# Altium project HW_Z-BAND_SMART_AMP_R1.PrjPcb (part 2 of 4)

## Sheet 05_3V3_GENERATION.SchDoc: =TitleParameter
size A3; Date: 6/12/2026; ApprovedBy: U.KAYACIK; CheckedBy: E. CAGLAV; DrawnBy: E. CAGLAV; Organization: ASISGUARD; Address1: Kemalpasa, Kemalpasa Cd. No:290 D:292H, 35060 Bornova/Izmir/Turkey; Revision: R1; SheetNumber: 5; SheetTotal: 12
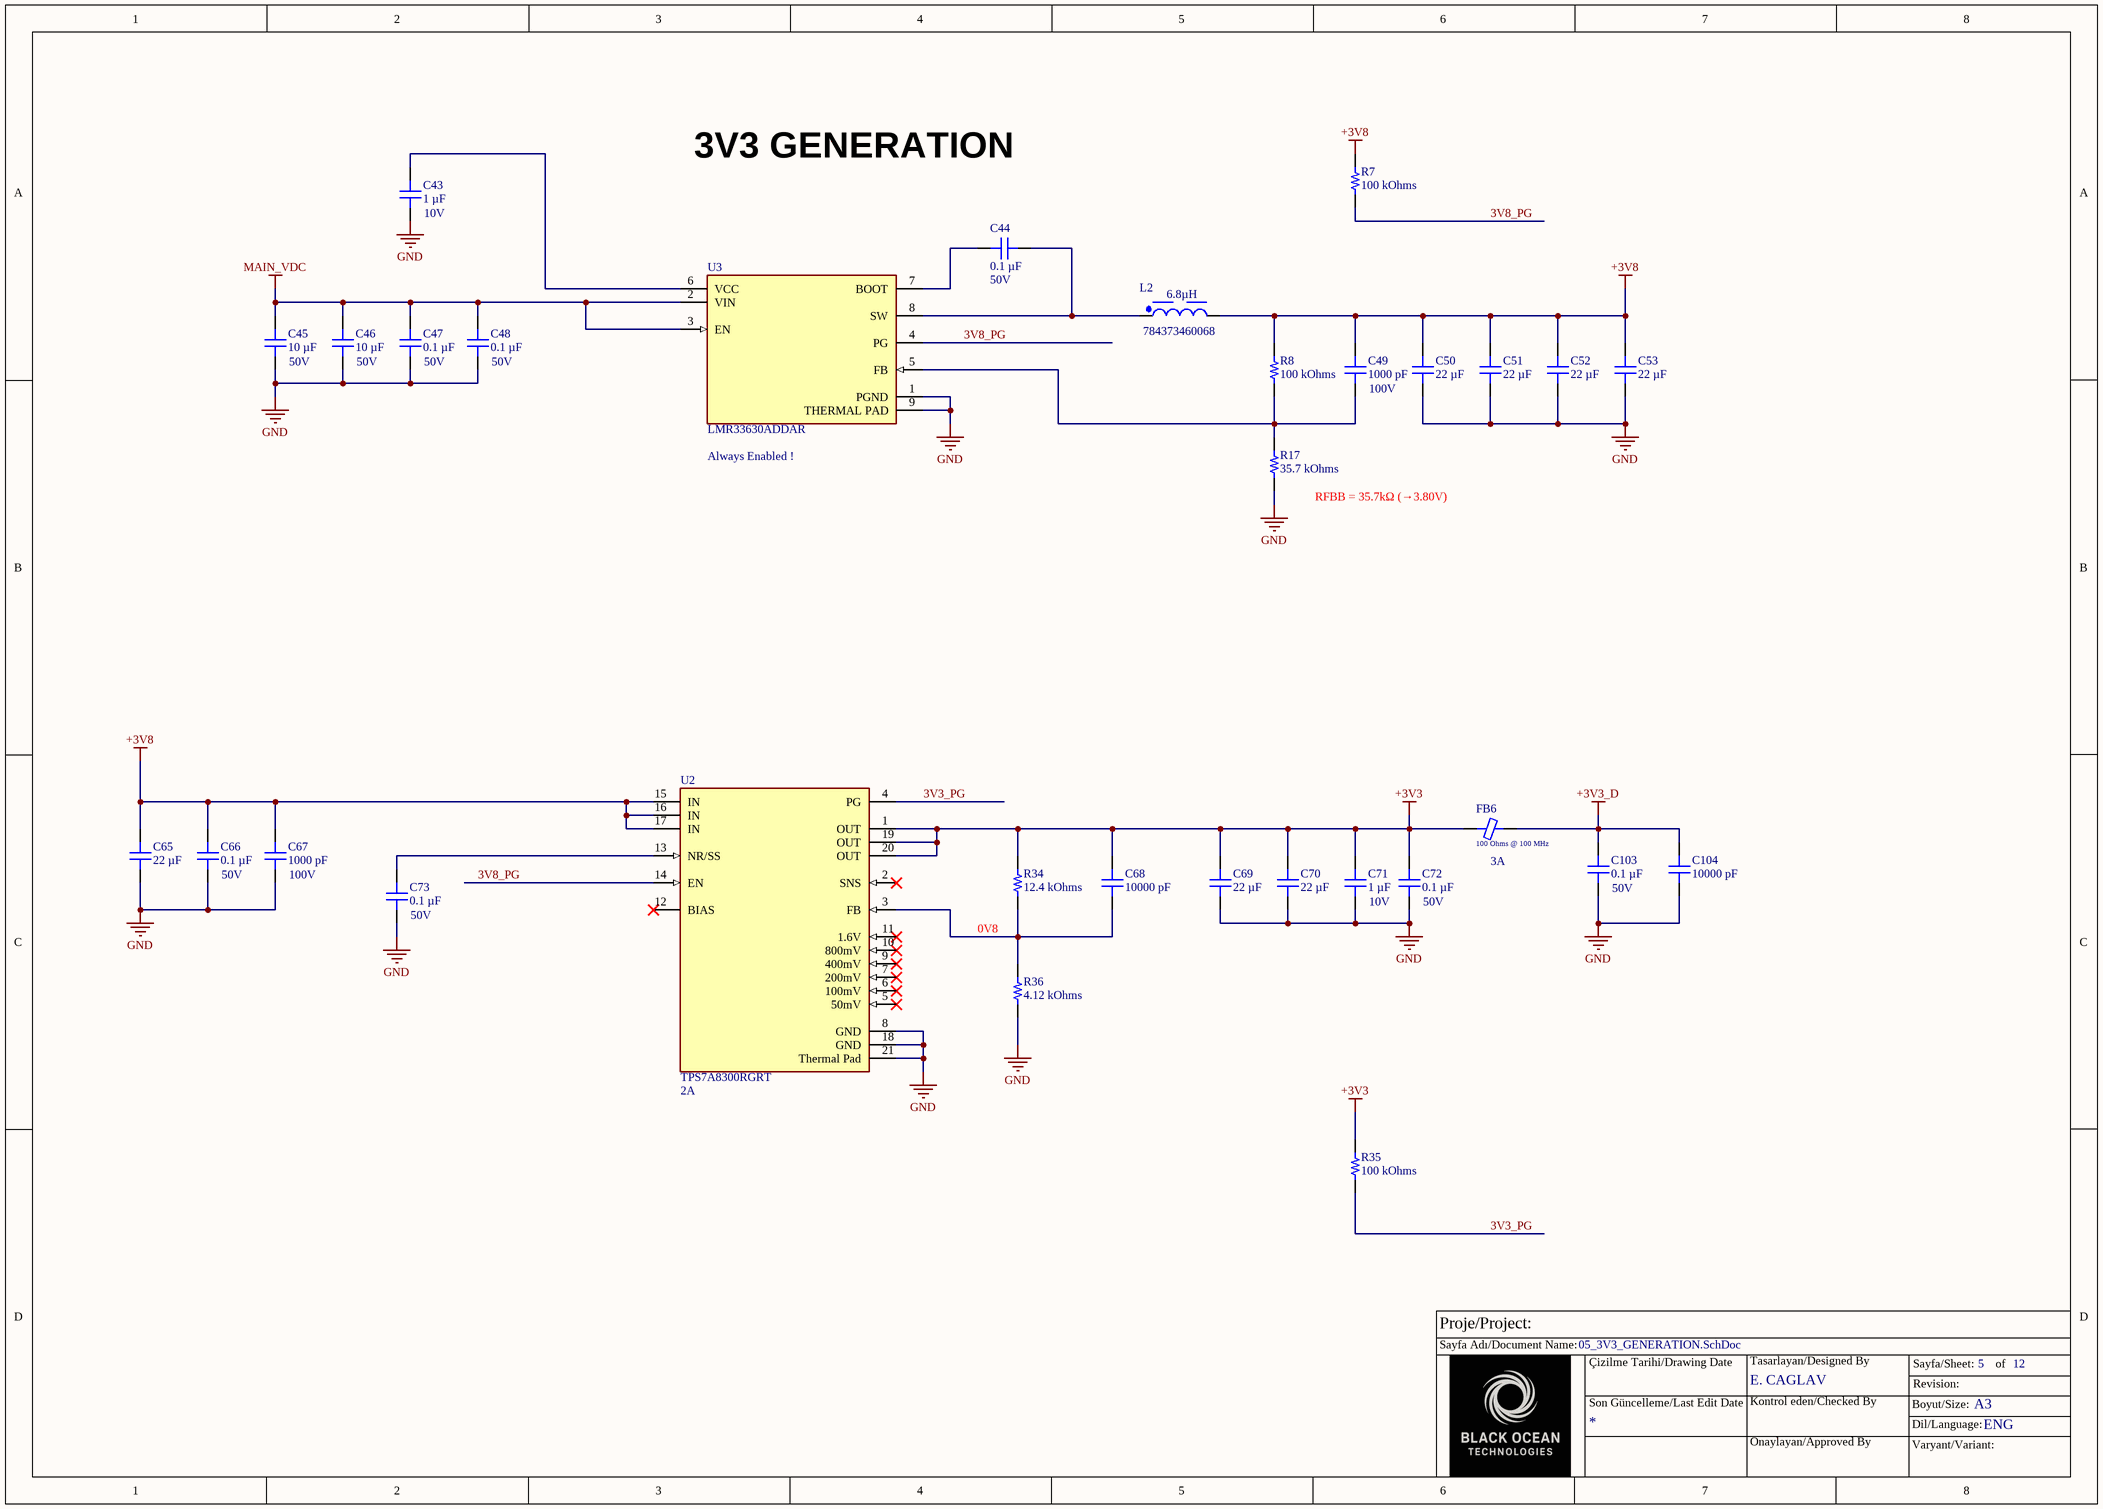
[diagram p4: 05_3V3_GENERATION.SchDoc]

### Parts
C43  Voltage - Rated: 10V  [CAP 0402_1005]  (hidden comment: 1 µF)
C44  Voltage - Rated: 50V  [CAP 0402_1005]  (hidden comment: 0.1 µF)
C45  Voltage - Rated: 50V  [CAP 1206_3216 - 0.8MM]  (hidden comment: 10 µF)
C46  Voltage - Rated: 50V  [CAP 1206_3216 - 0.8MM]  (hidden comment: 10 µF)
C47  Voltage - Rated: 50V  [CAP 0402_1005]  (hidden comment: 0.1 µF)
C48  Voltage - Rated: 50V  [CAP 0402_1005]  (hidden comment: 0.1 µF)
C49  Voltage - Rated: 100V  [CAP 0402_1005]  (hidden comment: 1000 pF)
C50  22 µF  [CAP 0805_2012]
C51  22 µF  [CAP 0805_2012]
C52  22 µF  [CAP 0805_2012]
C53  22 µF  [CAP 0805_2012]
C65  22 µF  [CAP 0805_2012]
C66  Voltage - Rated: 50V  [CAP 0402_1005]  (hidden comment: 0.1 µF)
C67  Voltage - Rated: 100V  [CAP 0402_1005]  (hidden comment: 1000 pF)
C68  10000 pF  [CAP 0402_1005]
C69  22 µF  [CAP 0805_2012]
C70  22 µF  [CAP 0805_2012]
C71  Voltage - Rated: 10V  [CAP 0402_1005]  (hidden comment: 1 µF)
C72  Voltage - Rated: 50V  [CAP 0402_1005]  (hidden comment: 0.1 µF)
C73  Voltage - Rated: 50V  [CAP 0402_1005]  (hidden comment: 0.1 µF)
C103  Voltage - Rated: 50V  [CAP 0402_1005]  (hidden comment: 0.1 µF)
C104  10000 pF  [CAP 0402_1005]
FB6  100 Ohms @ 100 MHz  Current Rating (Max): 3A  [FER 0603_1608]
L2  784373460068  Inductance: 6.8µH  [WE-LHCA_7030]
R7  100 kOhms  [RES 0402_1005]
R8  100 kOhms  [RES 0402_1005]
R17  35.7 kOhms  [RES 0402_1005]
R34  12.4 kOhms  [RES 0402_1005]
R35  100 kOhms  [RES 0402_1005]
R36  4.12 kOhms  [RES 0402_1005]
U2  TPS7A8300RGRT  Output Current: 2A  [FP-RGR0020A-MFG]
U3  LMR33630ADDAR  [FP-DDA0008J-MFG]

### Nets
+3V3: C68.2 C69.2 C70.2 C71.1 C72.2 FB6.2 R34.2 R35.2 U2.1(OUT) U2.19(OUT) U2.20(OUT)
+3V3_D: C103.2 C104.2 FB6.1
+3V8: C49.2 C50.2 C51.2 C52.2 C53.2 C65.2 C66.2 C67.2 L2.2 R7.2 R8.2 U2.15(IN) U2.16(IN) U2.17(IN)
GND: C43.2 C45.1 C46.1 C47.1 C48.1 C50.1 C51.1 C52.1 C53.1 C65.1 C66.1 C67.1 C69.1 C70.1 C71.2 C72.1 C73.1 C103.1 C104.1 R17.1 R36.1 U2.8(GND) U2.18(GND) U2.21(Thermal_Pad) U3.1(PGND) U3.9(THERMAL_PAD)
MAIN_VDC: C45.2 C46.2 C47.2 C48.2 U3.2(VIN) U3.3(EN)
3V3_PG: R35.1 U2.4(PG)
3V8_PG: R7.1 U2.14(EN) U3.4(PG)
NetC43_1: C43.1 U3.6(VCC)
NetC44_1: C44.1 L2.1 U3.8(SW)
NetC44_2: C44.2 U3.7(BOOT)
NetC49_1: C49.1 R8.1 R17.2 U3.5(FB)
NetC68_1: C68.1 R34.1 R36.2 U2.3(FB)
NetC73_2: C73.2 U2.13(NR/SS)

Not connected (* = marked no-connect by the designer): U2 2(SNS)* 5(50mV)* 6(100mV)* 7(200mV)* 9(400mV)* 10(800mV)* 11(1.6V)* 12(BIAS)*

### Notes on the sheet
- 3V3 GENERATION
- (near U3) Always Enabled !
- (near R17) RFBB = 35.7kΩ (→3.80V)
- 0V8
- Proje/Project:
- Sayfa Adı/Document Name:
- Çizilme Tarihi/Drawing Date
- E. CAGLAV
- Tasarlayan/Designed By
- Sayfa/Sheet:
- Revision:
- of
- Son Güncelleme/Last Edit Date
- Kontrol eden/Checked By
- Onaylayan/Approved By
- Boyut/Size:
- Varyant/Variant:
- Dil/Language:
- A3
- ENG

### Library data of the parts
C43 C71 = GRM155C71A105KE11D: CAP CER 1UF 10V X7S 0402; manufacturer: Murata Electronics; Tolerance: ±10%; Part Number: GRM155C71A105KE11D; Capacitance: 1 µF; Applications: General Purpose; componentlink1description: Datasheet; componentlink1url: https://search.murata.co.jp/Ceramy/image/img/A01X/G101/ENG/GRM155C71A105KE11-01.pdf; componentlink2description: DigiKey Link; componentlink2url: https://www.digikey.com/en/products/detail/murata-electronics/GRM155C71A105KE11D/6606086; Device Package: 0402 (1005 Metric); lastupdated: 4/6/2026 7:11:12 PM; Lifecycle Status: Active; Minimum Order: 1; Mounting Type: Surface Mount, MLCC; Operating Temperature: -55°C ~ 125°C; Package / Case: 0402 (1005 Metric); packaging: TapeAndReel; partid: 1749; Part Status: Active; price: 0.01; series: GRM; Size / Dimension: 0.039" L x 0.020" W (1.00mm x 0.50mm); Supplier 1: DigiKey; Supplier Part Number 1: 490-14457-1-ND; Temperature Coefficient: X7S; Thickness (Max): 0.024" (0.60mm); value: 1 µF
C44 C47 C48 C66 C72 C73 C103 = GCM155R71H104KE02J: CAP CER 0.1UF 50V X7R 0402; manufacturer: Murata Electronics; Tolerance: ±10%; Part Number: GCM155R71H104KE02J; Capacitance: 0.1 µF; Applications: Automotive; componentlink1description: Datasheet; componentlink1url: https://search.murata.co.jp/Ceramy/image/img/A01X/G101/ENG/GCM155R71H104KE02-01.pdf; componentlink2description: DigiKey Link; componentlink2url: https://www.digikey.com/en/products/detail/murata-electronics/GCM155R71H104KE02J/4903705; Device Package: 0402 (1005 Metric); lastupdated: 4/6/2026 7:10:30 PM; Lifecycle Status: Active; Minimum Order: 1; Mounting Type: Surface Mount, MLCC; Operating Temperature: -55°C ~ 125°C; Package / Case: 0402 (1005 Metric); packaging: TapeAndReel; partid: 11356; Part Status: Active; price: 0.01; Ratings: AEC-Q200; series: GCM; Size / Dimension: 0.039" L x 0.020" W (1.00mm x 0.50mm); Supplier 1: DigiKey; Supplier Part Number 1: 490-14514-1-ND; Temperature Coefficient: X7R; Thickness (Max): 0.022" (0.55mm); value: 0.1 µF
C45 C46 = CL31B106KBHNNNE: CAP CER 10UF 50V X7R 1206; manufacturer: Samsung Electro-Mechanics; Tolerance: ±10%; Part Number: CL31B106KBHNNNE; Capacitance: 10 µF; Applications: General Purpose; componentlink1description: Datasheet; componentlink1url: http://www.samsungsem.com/kr/support/product-search/mlcc/CL31B106KBHNNNE.jsp; componentlink2description: DigiKey Link; componentlink2url: https://www.digikey.com/en/products/detail/samsung-electro-mechanics/CL31B106KBHNNNE/5961251; Device Package: 1206 (3216 Metric); lastupdated: 4/6/2026 7:38:00 PM; Lifecycle Status: Active; Minimum Order: 1; Mounting Type: Surface Mount, MLCC; Operating Temperature: -55°C ~ 125°C; Package / Case: 1206 (3216 Metric); packaging: TapeAndReel; partid: 40563; Part Status: Active; price: 0.06; series: CL; Size / Dimension: 0.126" L x 0.063" W (3.20mm x 1.60mm); Supplier 1: DigiKey; Supplier Part Number 1: 1276-6767-1-ND; Temperature Coefficient: X7R; Thickness (Max): 0.071" (1.80mm); value: 10 µF
C49 C67 = C0402H102J1GAC7867: CAP CER 1000PF 100V C0G/NP0 0402; manufacturer: KEMET; Temperature Coefficient: C0G, NP0; Tolerance: ±5%; Part Number: C0402H102J1GAC7867; Capacitance: 1000 pF; Applications: Downhole; componentlink1description: Datasheet; componentlink1url: https://api.kemet.com/component-edge/download/datasheet/C0402H102J1GAC7867.pdf; componentlink2description: DigiKey Link; componentlink2url: https://www.digikey.com/en/products/detail/kemet/C0402H102J1GAC7867/5267578; Device Package: 0402 (1005 Metric); Features: Low ESL, High Temperature; lastupdated: 3/30/2026 7:10:31 PM; Lifecycle Status: Active; Minimum Order: 1; Mounting Type: Surface Mount, MLCC; Operating Temperature: -55°C ~ 200°C; Package / Case: 0402 (1005 Metric); packaging: TapeAndReel; partid: 3822; Part Status: Active; price: 0.24; series: SMD Indust C0G HT200C; Size / Dimension: 0.039" L x 0.020" W (1.00mm x 0.50mm); Supplier 1: DigiKey; Supplier Part Number 1: 399-11931-1-ND; Thickness (Max): 0.022" (0.55mm); value: 1000 pF
C50-C53 C65 C69 C70 = CL21A226KOQNNNE: CAP CER 22UF 16V X5R 0805; manufacturer: Samsung Electro-Mechanics; Tolerance: ±10%; Part Number: CL21A226KOQNNNE; Capacitance: 22 µF; Applications: General Purpose; componentlink1description: Datasheet; componentlink1url: http://www.samsungsem.com/kr/support/library/product-catalog/mlcc.jsp; componentlink2description: DigiKey Link; componentlink2url: https://www.digikey.com/en/products/detail/samsung-electro-mechanics/CL21A226KOQNNNE/5961010; Device Package: 0805 (2012 Metric); lastupdated: 4/6/2026 7:33:17 PM; Lifecycle Status: Active; Minimum Order: 1; Mounting Type: Surface Mount, MLCC; Operating Temperature: -55°C ~ 85°C; Package / Case: 0805 (2012 Metric); packaging: TapeAndReel; partid: 3004; Part Status: Active; price: 0.06; series: CL; Size / Dimension: 0.079" L x 0.049" W (2.00mm x 1.25mm); Supplier 1: DigiKey; Supplier Part Number 1: 1276-6526-1-ND; Temperature Coefficient: X5R; Thickness (Max): 0.055" (1.40mm); value: 22 µF; Voltage - Rated: 16V
C68 C104 = AC0402KPX7R9BB103: CAP CER 10000PF 50V X7R 0402; manufacturer: Yageo; Tolerance: ±10%; Part Number: AC0402KPX7R9BB103; Capacitance: 10000 pF; Applications: Automotive; componentlink1description: Datasheet; componentlink1url: http://www.yageo.com/documents/recent/UPY-AC_NP0X7R_16V-to-630V_12.pdf; componentlink2description: DigiKey Link; componentlink2url: https://www.digikey.com/en/products/detail/yageo/AC0402KPX7R9BB103/6643253; Device Package: 0402 (1005 Metric); lastupdated: 4/6/2026 7:11:07 PM; Lifecycle Status: Active; Minimum Order: 1; Mounting Type: Surface Mount, MLCC; Operating Temperature: -55°C ~ 125°C; Package / Case: 0402 (1005 Metric); packaging: CutTape; partid: 2384; Part Status: Active; price: 0.01; Ratings: AEC-Q200; series: AC; Size / Dimension: 0.039" L x 0.020" W (1.00mm x 0.50mm); Supplier 1: DigiKey; Supplier Part Number 1: 311-3267-1-ND; Temperature Coefficient: X7R; Thickness (Max): 0.022" (0.55mm); value: 10000 pF; Voltage - Rated: 50V
FB6 = MH1608-101Y: FERRITE BEAD 100 OHM 0603 1LN; Manufacturer: Bourns Inc.; DC Resistance (DCR) (Max): 40mOhm; Filter Type: Power, Signal Line; Number of Lines: 1; Part Number: MH1608-101Y; ComponentLink1Description: Datasheet; ComponentLink1URL: https://www.bourns.com/docs/Product-Datasheets/mh.pdf; ComponentLink2Description: DigiKey Link; ComponentLink2URL: https://www.digikey.com/en/products/detail/bourns-inc/MH1608-101Y/2563310; Device Package: 0603 (1608 Metric); Height (Max): 0.039" (1.00mm); Impedance @ Frequency: 100 Ohms @ 100 MHz; LastUpdated: 5/9/2023 8:13:07 PM; Lifecycle Status: Active; Minimum Order: 1; Mounting Type: Surface Mount; Operating Temperature: -55°C ~ 125°C; Package / Case: 0603 (1608 Metric); Packaging: TapeAndReel; PartId: 645; Part Status: Active; Price: 0.02; Series: MH; Size / Dimension: 0.063" L x 0.032" W (1.60mm x 0.80mm); Supplier 1: DigiKey; Supplier Part Number 1: MH1608-101YCT-ND; Value: 100 Ohms @ 100 MHz
L2 = CMP-03913-134708979-2: Power Inductor, 6.8UH, 4.5A, Shielded Rohs Compliant: Yes; DC Resistance (DCR): 49.9mΩ; Current Rating: 4A; Min Operating Temperature: -55°C; Width: 6.5mm; RoHS: Compliant; Max Operating Temperature: 155°C; Ambient Temperature Range High: 100°C; Length: 7mm; Height: 3mm; Ambient Temperature Range Low: -55°C
R7 R35 = AC0402FR-07100KL: RES SMD 100K OHM 1% 1/16W 0402; Manufacturer: Yageo; Power (Watts): 0.063W, 1/16W; Temperature Coefficient: ±100ppm/°C; Part Number: AC0402FR-07100KL; Value: 100 kOhms; ComponentLink1Description: Datasheet; ComponentLink1URL: https://www.yageo.com/upload/media/product/productsearch/datasheet/rchip/PYu-AC_51_RoHS_L_7.pdf; ComponentLink2Description: DigiKey Link; ComponentLink2URL: https://www.digikey.com/en/products/detail/yageo/AC0402FR-07100KL/5895021; Composition: Thick Film; Device Package: 0402 (1005 Metric); Features: Automotive AEC-Q200, Moisture Resistant; Height - Seated (Max): 0.015" (0.37mm); LastUpdated: 4/6/2026 7:41:12 PM; Lifecycle Status: Active; Minimum Order: 1; Number of Terminations: 2; Operating Temperature: -55°C ~ 155°C; Package / Case: 0402 (1005 Metric); Packaging: CutTape; PartId: 12047; Part Status: Active; Price: 0.01; Ratings: AEC-Q200; Resistance: 100 kOhms; Series: AC; Size / Dimension: 0.039" L x 0.020" W (1.00mm x 0.50mm); Supplier 1: DigiKey; Supplier Part Number 1: YAG3434CT-ND; Supplier Device Package: 0402; Tolerance: ±1%
R8 = RC0402FR-13100KL: RES 100K OHM 1% 1/16W 0402; Manufacturer: Yageo; Power (Watts): 0.063W, 1/16W; Temperature Coefficient: ±100ppm/°C; Part Number: RC0402FR-13100KL; Value: 100 kOhms; ComponentLink1Description: Datasheet; ComponentLink1URL: https://www.yageo.com/upload/media/product/productsearch/datasheet/rchip/PYu-RC_Group_51_RoHS_L_11.pdf; ComponentLink2Description: DigiKey Link; ComponentLink2URL: https://www.digikey.com/en/products/detail/yageo/RC0402FR-13100KL/13546624; Composition: Thick Film; Device Package: 0402 (1005 Metric); Features: Moisture Resistant; Height - Seated (Max): 0.016" (0.40mm); LastUpdated: 4/6/2026 7:40:59 PM; Lifecycle Status: Active; Minimum Order: 1; Number of Terminations: 2; Operating Temperature: -55°C ~ 155°C; Package / Case: 0402 (1005 Metric); Packaging: CutTape; PartId: 59069; Part Status: Active; Price: 0.01; Resistance: 100 kOhms; Series: RC_L; Size / Dimension: 0.039" L x 0.020" W (1.00mm x 0.50mm); Supplier 1: DigiKey; Supplier Part Number 1: 13-RC0402FR-13100KLCT-ND; Supplier Device Package: 0402; Tolerance: ±1%
R17 = ERA-2AEB3572X: RES SMD 35.7KOHM 0.1% 1/16W 0402; Manufacturer: Panasonic Electronic Components; Power (Watts): 0.063W, 1/16W; Temperature Coefficient: ±25ppm/°C; Part Number: ERA-2AEB3572X; Value: 35.7 kOhms; ComponentLink1Description: Datasheet; ComponentLink1URL: https://industrial.panasonic.com/cdbs/www-data/pdf/RDM0000/AOA0000C307.pdf; ComponentLink2Description: DigiKey Link; ComponentLink2URL: https://www.digikey.com/en/products/detail/panasonic-electronic-components/ERA-2AEB3572X/2026192; Composition: Thin Film; Device Package: 0402 (1005 Metric); Features: Automotive AEC-Q200; Height - Seated (Max): 0.016" (0.40mm); LastUpdated: 2/9/2024 8:29:52 PM; Lifecycle Status: Active; Minimum Order: 1; Number of Terminations: 2; Operating Temperature: -55°C ~ 155°C; Package / Case: 0402 (1005 Metric); Packaging: TapeAndReel; PartId: 11364; Part Status: Active; Price: 0.04; Ratings: AEC-Q200; Resistance: 35.7 kOhms; Series: ERA-2A; Size / Dimension: 0.039" L x 0.020" W (1.00mm x 0.50mm); Supplier 1: DigiKey; Supplier Part Number 1: P35.7KDCCT-ND; Supplier Device Package: 0402; Tolerance: ±0.1%
R34 = AC0402FR-0712K4L: RES SMD 12.4K OHM 1% 1/16W 0402; Manufacturer: Yageo; Power (Watts): 0.063W, 1/16W; Temperature Coefficient: ±100ppm/°C; Part Number: AC0402FR-0712K4L; Value: 12.4 kOhms; ComponentLink1Description: Datasheet; ComponentLink1URL: https://www.yageo.com/upload/media/product/productsearch/datasheet/rchip/PYu-AC_51_RoHS_L_7.pdf; ComponentLink2Description: DigiKey Link; ComponentLink2URL: https://www.digikey.com/en/products/detail/yageo/AC0402FR-0712K4L/5895055; Composition: Thick Film; Device Package: 0402 (1005 Metric); Features: Automotive AEC-Q200, Moisture Resistant; Height - Seated (Max): 0.015" (0.37mm); LastUpdated: 4/6/2026 7:41:12 PM; Lifecycle Status: Active; Minimum Order: 1; Number of Terminations: 2; Operating Temperature: -55°C ~ 155°C; Package / Case: 0402 (1005 Metric); Packaging: CutTape; PartId: 11140; Part Status: Active; Price: 0.01; Ratings: AEC-Q200; Resistance: 12.4 kOhms; Series: AC; Size / Dimension: 0.039" L x 0.020" W (1.00mm x 0.50mm); Supplier 1: DigiKey; Supplier Part Number 1: YAG5256CT-ND; Supplier Device Package: 0402; Tolerance: ±1%
R36 = ERA-2AEB4121X: RES SMD 4.12KOHM 0.1% 1/16W 0402; Manufacturer: Panasonic Electronic Components; Power (Watts): 0.063W, 1/16W; Temperature Coefficient: ±25ppm/°C; Part Number: ERA-2AEB4121X; Value: 4.12 kOhms; ComponentLink1Description: Datasheet; ComponentLink1URL: https://industrial.panasonic.com/cdbs/www-data/pdf/RDM0000/AOA0000C307.pdf; ComponentLink2Description: DigiKey Link; ComponentLink2URL: https://www.digikey.com/en/products/detail/panasonic-electronic-components/ERA-2AEB4121X/2026108; Composition: Thin Film; Device Package: 0402 (1005 Metric); Features: Automotive AEC-Q200; Height - Seated (Max): 0.016" (0.40mm); LastUpdated: 2/9/2024 8:30:08 PM; Lifecycle Status: Active; Minimum Order: 1; Number of Terminations: 2; Operating Temperature: -55°C ~ 155°C; Package / Case: 0402 (1005 Metric); Packaging: TapeAndReel; PartId: 6142; Part Status: Active; Price: 0.04; Ratings: AEC-Q200; Resistance: 4.12 kOhms; Series: ERA-2A; Size / Dimension: 0.039" L x 0.020" W (1.00mm x 0.50mm); Supplier 1: DigiKey; Supplier Part Number 1: P4.12KDCCT-ND; Supplier Device Package: 0402; Tolerance: ±0.1%
U2 = CMP-2000-07286-2: IC REG LINEAR POS ADJ 2A 20VQFN; Max Output Voltage: 5V; Min Output Voltage: 800mV; Min Input Voltage: 1.1V; Min Current Limit: 2.1A; Power Supply Rejection Ratio (PSRR): 40dB; Quiescent Current: 2.8mA; Accuracy: 1%; Number of Outputs: 1; Max Input Voltage: 6.5V; Output Type: Adjustable; Polarity: Positive; Dropout Voltage: 125mV; Number of Pins: 20; Package Quantity: 250; Lead Free: Lead Free; Packaging: Tape and Reel; RoHS Compliant: Yes; Radiation Hardening: No; Output Voltage: 5V; Case/Package: VQFN; Min Operating Temperature: -40°C; Max Operating Temperature: 125°C; Mount: Surface Mount; REACH SVHC: No SVHC; Max Output Current: 2A; Number of Regulators: 1; Reference Voltage: 800mV; Weight: 0.002469oz; Contact Plating: Gold
U3 = CMP-04918-000184-1: IC REG BUCK ADJUSTABLE 3A 8SOPWR; Switching Frequency: 400kHz; Number of Outputs: 1; Output Configuration: Positive; Synchronous Rectifier: Yes; Min Output Voltage: 1V; Max Output Voltage: 24V; Max Input Voltage: 36V; Min Input Voltage: 3.8V; Output Current: 3A; Min Operating Temperature: -40°C; Max Operating Temperature: 125°C; Number of Pins: 8; RoHS Compliant: Yes; Mount: Surface Mount; Output Type: Adjustable; Packaging: Cut Tape

## Sheet 06_MCU.SchDoc: =TitleParameter
size A3; Date: 6/12/2026; ApprovedBy: U.KAYACIK; CheckedBy: E. CAGLAV; DrawnBy: E. CAGLAV; Organization: ASISGUARD; Address1: Kemalpasa, Kemalpasa Cd. No:290 D:292H, 35060 Bornova/Izmir/Turkey; Revision: R1; SheetNumber: 6; SheetTotal: 12
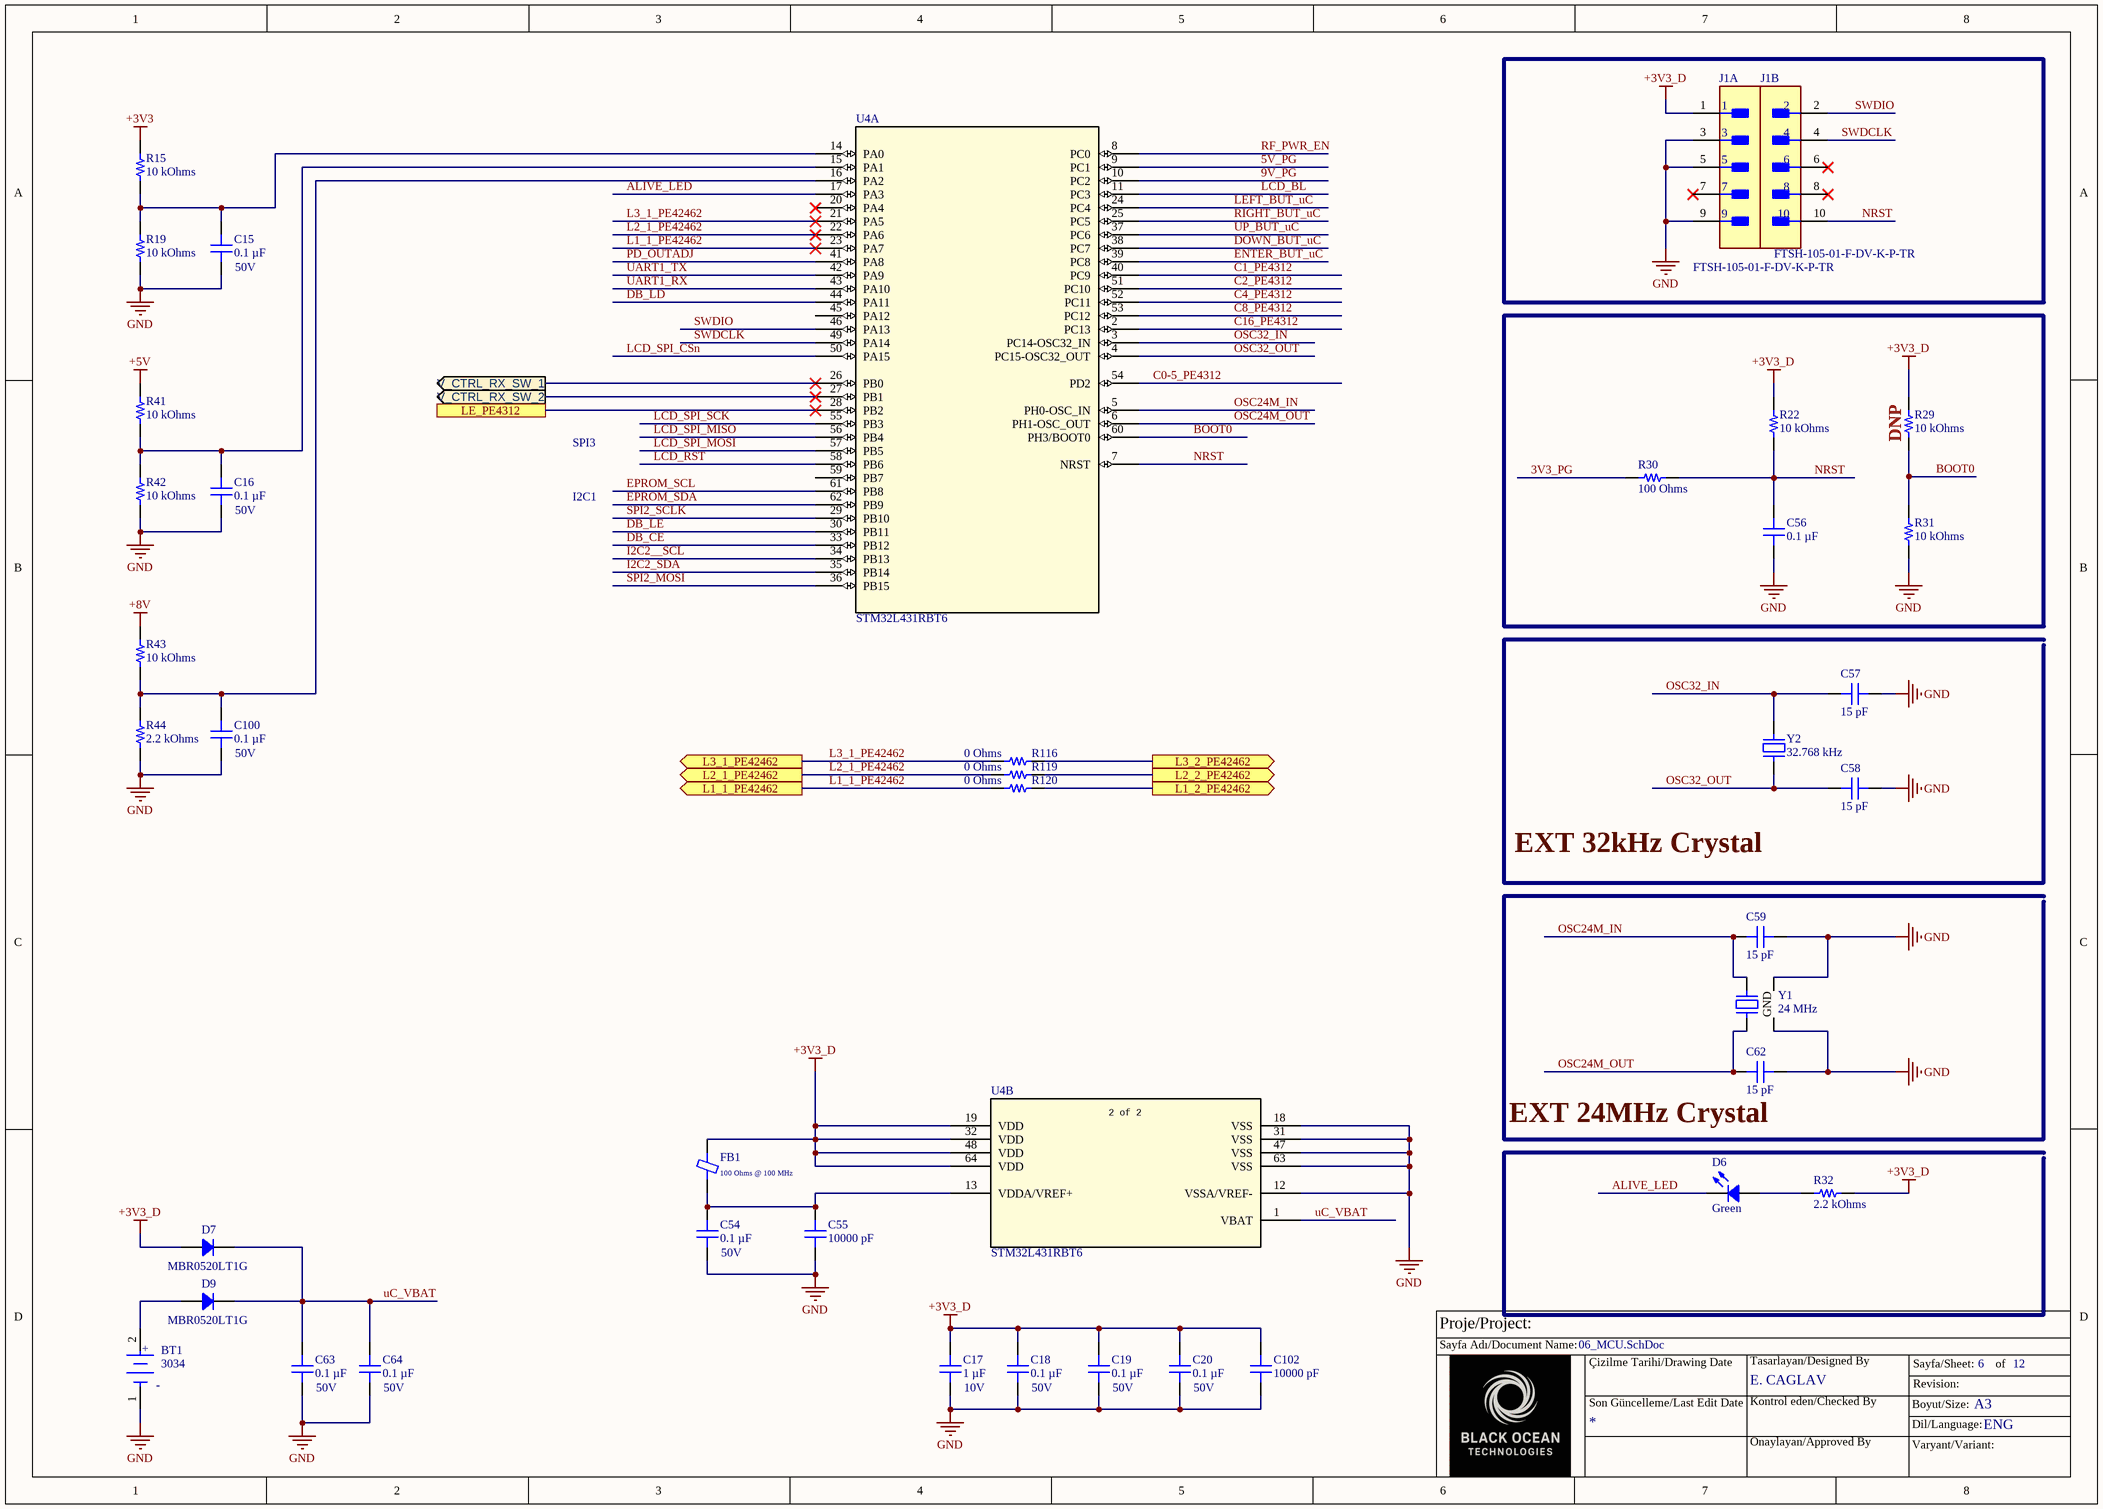
[diagram p5: 06_MCU.SchDoc]

### Parts
BT1  3034  [FP-3034-MFG]
C15  Voltage - Rated: 50V  [CAP 0402_1005]  (hidden comment: 0.1 µF)
C16  Voltage - Rated: 50V  [CAP 0402_1005]  (hidden comment: 0.1 µF)
C17  Voltage - Rated: 10V  [CAP 0402_1005]  (hidden comment: 1 µF)
C18  Voltage - Rated: 50V  [CAP 0402_1005]  (hidden comment: 0.1 µF)
C19  Voltage - Rated: 50V  [CAP 0402_1005]  (hidden comment: 0.1 µF)
C20  Voltage - Rated: 50V  [CAP 0402_1005]  (hidden comment: 0.1 µF)
C54  Voltage - Rated: 50V  [CAP 0402_1005]  (hidden comment: 0.1 µF)
C55  10000 pF  [CAP 0402_1005]
C56  0.1 µF  [CAP 0402_1005]
C57  15 pF  [CAP 0402_1005]
C58  15 pF  [CAP 0402_1005]
C59  15 pF  [CAP 0402_1005]
C62  15 pF  [CAP 0402_1005]
C63  Voltage - Rated: 50V  [CAP 0402_1005]  (hidden comment: 0.1 µF)
C64  Voltage - Rated: 50V  [CAP 0402_1005]  (hidden comment: 0.1 µF)
C100  Voltage - Rated: 50V  [CAP 0402_1005]  (hidden comment: 0.1 µF)
C102  10000 pF  [CAP 0402_1005]
D6  Green  [LED 0603_1608 GREEN]
D7  MBR0520LT1G  [SOD-123]
D9  MBR0520LT1G  [SOD-123]
FB1  100 Ohms @ 100 MHz  [FER 0603_1608]
J1  FTSH-105-01-F-DV-K-P-TR  [FP-FTSH-105-01-F-DV-K-P-T-MFG]  (parts A,B of 2)
R15  10 kOhms  [RES 0402_1005]
R19  10 kOhms  [RES 0402_1005]
R22  10 kOhms  [RES 0402_1005]
R29  10 kOhms  [RES 0402_1005]
R30  100 Ohms  [RES 0402_1005]
R31  10 kOhms  [RES 0402_1005]
R32  2.2 kOhms  [RES 0402_1005]
R41  10 kOhms  [RES 0402_1005]
R42  10 kOhms  [RES 0402_1005]
R43  10 kOhms  [RES 0402_1005]
R44  2.2 kOhms  [RES 0402_1005]
R116  0 Ohms  [RES 0402_1005]
R119  0 Ohms  [RES 0402_1005]
R120  0 Ohms  [RES 0402_1005]
U4  STM32L431RBT6  [LQFP-64]  (parts A,B of 2)
Y1  24 MHz  [EPSON TSX-3225]
Y2  32.768 kHz  [ABRACON ABS06]

### Blocks framed on the sheet
DNP: C56 R22 R29-R31

### Ports
L1_1_PE42462 (out), L1_2_PE42462 (out), L2_1_PE42462 (out), L2_2_PE42462 (out), L3_1_PE42462 (out), L3_2_PE42462 (out), LE_PE4312, V_CTRL_RX_SW_1 (out), V_CTRL_RX_SW_2 (out)

### Nets
+3V3: R15.2
+3V3_D: C17.1 C18.2 C19.2 C20.2 C102.2 D7.1 FB1.2 J1.1 R22.1 R29.1 R32.2 U4.19(VDD) U4.32(VDD) U4.48(VDD) U4.64(VDD)
+5V: R41.2
+8V: R43.2
GND: BT1.1(C) C15.1 C16.1 C17.2 C18.1 C19.1 C20.1 C54.1 C55.1 C56.1 C57.2 C58.2 C59.2 C62.2 C63.1 C64.1 C100.1 C102.1 J1.3 J1.5 J1.9 R19.1 R31.2 R42.1 R44.1 U4.12(VSSA/VREF-) U4.18(VSS) U4.31(VSS) U4.47(VSS) U4.63(VSS) Y1.2(GND) Y1.4(GND)
3V3_PG: R30.1
5V_PG: U4.9(PC1)
9V_PG: U4.10(PC2)
ALIVE_LED: D6.2 U4.17(PA3)
BOOT0: R29.2 R31.1 U4.60(PH3/BOOT0)
C0-5_PE4312: U4.54(PD2)
C1_PE4312: U4.40(PC9)
C2_PE4312: U4.51(PC10)
C4_PE4312: U4.52(PC11)
C8_PE4312: U4.53(PC12)
C16_PE4312: U4.2(PC13)
DB_CE: U4.33(PB12)
DB_LD: U4.44(PA11)
DB_LE: U4.30(PB11)
DOWN_BUT_uC: U4.38(PC7)
ENTER_BUT_uC: U4.39(PC8)
EPROM_SCL: U4.61(PB8)
EPROM_SDA: U4.62(PB9)
I2C2__SCL: U4.34(PB13)
I2C2_SDA: U4.35(PB14)
L1_1_PE42462: R120.1 U4.23(PA7) ; port L1_1_PE42462
L2_1_PE42462: R119.1 U4.22(PA6) ; port L2_1_PE42462
L3_1_PE42462: R116.1 U4.21(PA5) ; port L3_1_PE42462
LCD_BL: U4.11(PC3)
LCD_RST: U4.58(PB6)
LCD_SPI_CSn: U4.50(PA15)
LCD_SPI_MISO: U4.56(PB4)
LCD_SPI_MOSI: U4.57(PB5)
LCD_SPI_SCK: U4.55(PB3)
LEFT_BUT_uC: U4.24(PC4)
NRST: C56.2 J1.10 R22.2 R30.2 U4.7(NRST)
OSC24M_IN: C59.1 U4.5(PH0-OSC_IN) Y1.3
OSC24M_OUT: C62.1 U4.6(PH1-OSC_OUT) Y1.1
OSC32_IN: C57.1 U4.3(PC14-OSC32_IN) Y2.2
OSC32_OUT: C58.1 U4.4(PC15-OSC32_OUT) Y2.1
PD_OUTADJ: U4.41(PA8)
RF_PWR_EN: U4.8(PC0)
RIGHT_BUT_uC: U4.25(PC5)
SPI2_MOSI: U4.36(PB15)
SPI2_SCLK: U4.29(PB10)
SWDCLK: J1.4 U4.49(PA14)
SWDIO: J1.2 U4.46(PA13)
UART1_RX: U4.43(PA10)
UART1_TX: U4.42(PA9)
uC_VBAT: C63.2 C64.2 D7.2 D9.2 U4.1(VBAT)
UP_BUT_uC: U4.37(PC6)
NetBT1_2: BT1.2(A) D9.1
NetC15_2: C15.2 R15.1 R19.2 U4.14(PA0)
NetC16_2: C16.2 R41.1 R42.2 U4.15(PA1)
NetC54_2: C54.2 C55.2 FB1.1 U4.13(VDDA/VREF+)
NetC100_2: C100.2 R43.1 R44.2 U4.16(PA2)
NetD6_1: D6.1 R32.1
NetR53_1: U4.28(PB2) ; port LE_PE4312
NetR69_2: R116.2 ; port L3_2_PE42462
NetR70_2: R119.2 ; port L2_2_PE42462
NetR71_2: R120.2 ; port L1_2_PE42462
NetU4_26: U4.26(PB0) ; port V_CTRL_RX_SW_1
NetU4_27: U4.27(PB1) ; port V_CTRL_RX_SW_2

Not connected (* = marked no-connect by the designer): J1 6* 7* 8*; U4 20(PA4)* 45(PA12) 59(PB7)

### Notes on the sheet
- SPI3
- I2C1
- EXT 32kHz Crystal
- (near C62) EXT 24MHz Crystal
- Proje/Project:
- Sayfa Adı/Document Name:
- Çizilme Tarihi/Drawing Date
- E. CAGLAV
- Tasarlayan/Designed By
- Sayfa/Sheet:
- Revision:
- of
- Son Güncelleme/Last Edit Date
- Kontrol eden/Checked By
- Onaylayan/Approved By
- Boyut/Size:
- Varyant/Variant:
- Dil/Language:
- A3
- ENG
- (in symbol CMP-19636-000006-1) +; -
- (in symbol STM32L431RBT6, part B) 2 of 2

### Library data of the parts
BT1 = CMP-19636-000006-1: BATTERY RETAINER COIN 20MM SMD; Manufacturer: Keystone Electronics; Number Of Contacts: 2; Height: 4.31mm; Device Class L1: Connectors; Device Class L3: unset; RoHS: TRUE; Automotive: No; Mouser Description: Coin Cell Battery Holders COIN CELL RETAINER; Contact Material: Nickel; Digikey Description: BATTERY RETAINER COIN 20MM SMD; Category: Batt; Package: 3034; ComponentLink2URL: https://www.keyelco.com/product-pdf.cfm?p=798; Manufacturer Part Number: 3034; Octopart: https://octopart.com/3034-keystone-27554462; ComponentLink2Description: Datasheet; Device Class L2: unset; Lead Free: Yes
C15 C16 C18-C20 C54 C63 C64 C100 = GCM155R71H104KE02J: as C44 on sheet 05_3V3_GENERATION; Part Number: GCM155R71H104KE02J; Capacitance: 0.1 µF; Applications: Automotive; componentlink1description: Datasheet; componentlink1url: https://search.murata.co.jp/Ceramy/image/img/A01X/G101/ENG/GCM155R71H104KE02-01.pdf; componentlink2description: DigiKey Link; componentlink2url: https://www.digikey.com/en/products/detail/murata-electronics/GCM155R71H104KE02J/4903705; Device Package: 0402 (1005 Metric); lastupdated: 4/6/2026 7:10:30 PM; Lifecycle Status: Active; Minimum Order: 1; Mounting Type: Surface Mount, MLCC; Operating Temperature: -55°C ~ 125°C; Package / Case: 0402 (1005 Metric); packaging: TapeAndReel; partid: 11356; Part Status: Active; price: 0.01; Ratings: AEC-Q200; series: GCM; Size / Dimension: 0.039" L x 0.020" W (1.00mm x 0.50mm); Supplier 1: DigiKey; Supplier Part Number 1: 490-14514-1-ND; Temperature Coefficient: X7R; Thickness (Max): 0.022" (0.55mm); value: 0.1 µF
C17 = GRM155C71A105KE11D: as C43 on sheet 05_3V3_GENERATION; Part Number: GRM155C71A105KE11D; Capacitance: 1 µF; Applications: General Purpose; componentlink1description: Datasheet; componentlink1url: https://search.murata.co.jp/Ceramy/image/img/A01X/G101/ENG/GRM155C71A105KE11-01.pdf; componentlink2description: DigiKey Link; componentlink2url: https://www.digikey.com/en/products/detail/murata-electronics/GRM155C71A105KE11D/6606086; Device Package: 0402 (1005 Metric); lastupdated: 4/6/2026 7:11:12 PM; Lifecycle Status: Active; Minimum Order: 1; Mounting Type: Surface Mount, MLCC; Operating Temperature: -55°C ~ 125°C; Package / Case: 0402 (1005 Metric); packaging: TapeAndReel; partid: 1749; Part Status: Active; price: 0.01; series: GRM; Size / Dimension: 0.039" L x 0.020" W (1.00mm x 0.50mm); Supplier 1: DigiKey; Supplier Part Number 1: 490-14457-1-ND; Temperature Coefficient: X7S; Thickness (Max): 0.024" (0.60mm); value: 1 µF
C55 C102 = AC0402KPX7R9BB103: as C68 on sheet 05_3V3_GENERATION; Part Number: AC0402KPX7R9BB103; Capacitance: 10000 pF; Applications: Automotive; componentlink1description: Datasheet; componentlink1url: http://www.yageo.com/documents/recent/UPY-AC_NP0X7R_16V-to-630V_12.pdf; componentlink2description: DigiKey Link; componentlink2url: https://www.digikey.com/en/products/detail/yageo/AC0402KPX7R9BB103/6643253; Device Package: 0402 (1005 Metric); lastupdated: 4/6/2026 7:11:07 PM; Lifecycle Status: Active; Minimum Order: 1; Mounting Type: Surface Mount, MLCC; Operating Temperature: -55°C ~ 125°C; Package / Case: 0402 (1005 Metric); packaging: CutTape; partid: 2384; Part Status: Active; price: 0.01; Ratings: AEC-Q200; series: AC; Size / Dimension: 0.039" L x 0.020" W (1.00mm x 0.50mm); Supplier 1: DigiKey; Supplier Part Number 1: 311-3267-1-ND; Temperature Coefficient: X7R; Thickness (Max): 0.022" (0.55mm); value: 10000 pF; Voltage - Rated: 50V
C56 = GRM155R71H104KE14J: CAP CER 0.1UF 50V X7R 0402; manufacturer: Murata Electronics; Tolerance: ±10%; Part Number: GRM155R71H104KE14J; Capacitance: 0.1 µF; Applications: General Purpose; componentlink1description: Datasheet; componentlink1url: https://search.murata.co.jp/Ceramy/image/img/A01X/G101/ENG/GRM155R71H104KE14-01.pdf; componentlink2description: DigiKey Link; componentlink2url: https://www.digikey.com/en/products/detail/murata-electronics/GRM155R71H104KE14J/4905180; Device Package: 0402 (1005 Metric); lastupdated: 4/6/2026 7:11:00 PM; Lifecycle Status: Active; Minimum Order: 1; Mounting Type: Surface Mount, MLCC; Operating Temperature: -55°C ~ 125°C; Package / Case: 0402 (1005 Metric); packaging: CutTape; partid: 4071; Part Status: Active; price: 0.01; series: GRM; Size / Dimension: 0.039" L x 0.020" W (1.00mm x 0.50mm); Supplier 1: DigiKey; Supplier Part Number 1: 490-13342-1-ND; Temperature Coefficient: X7R; Thickness (Max): 0.022" (0.55mm); value: 0.1 µF; Voltage - Rated: 50V
C57-C59 C62 = CC0402GRNPO9BN150: CAP CER 15PF 50V C0G/NPO 0402; manufacturer: Yageo; Temperature Coefficient: C0G, NP0; Tolerance: ±2%; Part Number: CC0402GRNPO9BN150; Capacitance: 15 pF; Applications: General Purpose; componentlink1description: Datasheet; componentlink1url: https://www.yageo.com/upload/media/product/productsearch/datasheet/mlcc/UPY-GP_NP0_16V-to-50V_17.pdf; componentlink2description: DigiKey Link; componentlink2url: https://www.digikey.com/en/products/detail/yageo/CC0402GRNPO9BN150/5195058; Device Package: 0402 (1005 Metric); lastupdated: 4/6/2026 7:11:11 PM; Lifecycle Status: Active; Minimum Order: 1; Mounting Type: Surface Mount, MLCC; Operating Temperature: -55°C ~ 125°C; Package / Case: 0402 (1005 Metric); packaging: TapeAndReel; partid: 1901; Part Status: Active; price: 0.01; series: CC; Size / Dimension: 0.039" L x 0.020" W (1.00mm x 0.50mm); Supplier 1: DigiKey; Supplier Part Number 1: 311-1649-1-ND; Thickness (Max): 0.022" (0.55mm); value: 15 pF; Voltage - Rated: 50V
D6 = TLMP1100-GS08: LED GREEN 0603 SMD; Manufacturer: Vishay Semiconductor Opto Division; Configuration: Standard; Current - Test: 20mA; Lens Color: 0.65mm; Lens Size: 1.60mm x 0.80mm; Lens Style: Rectangle with Flat Top; Millicandela Rating: 15mcd; Viewing Angle: 160°; Voltage - Forward (Vf) (Typ): 2.1V; Wavelength - Dominant: 561nm; Wavelength - Peak: 562nm; Part Number: TLMP1100-GS08; Color: Green; ComponentLink1Description: Datasheet; ComponentLink1URL: http://www.vishay.com/docs/83173/tlmb1100.pdf; ComponentLink2Description: DigiKey Link; ComponentLink2URL: https://www.digikey.com/en/products/detail/vishay-semiconductor-opto-division/TLMP1100-GS08/1681311; Device Package: 0603 (1608 Metric); Height (Max): 0.65mm; LastUpdated: 3/11/2024 7:51:09 AM; Lifecycle Status: Active; Minimum Order: 1; Mounting Type: Surface Mount; Package / Case: 0603 (1608 Metric); Packaging: TapeAndReel; PartId: 692; Part Status: Active; Price: 0.11; Series: Automotive, AEC-Q101; Size / Dimension: 1.60mm L x 0.80mm W; Supplier 1: DigiKey; Supplier Part Number 1: 751-1176-1-ND; Supplier Device Package: 0603; Value: Green
D7 D9 = MBR0520LT1G: DIODE SCHOTTKY 20V 500MA SOD123; Manufacturer: ON Semiconductor; Current - Reverse Leakage @ Vr: 250µA @ 20V; Speed: Fast Recovery =< 500ns, > 200mA (Io); Voltage - Forward (Vf) (Max) @ If: 385mV @ 500mA; Part Number: MBR0520LT1G; ComponentLink1Description: Datasheet; ComponentLink1URL: http://www.onsemi.com/pub/Collateral/MBR0520LT1-D.PDF; ComponentLink2Description: DigiKey Link; ComponentLink2URL: http://digikey.com/product-detail/en/on-semiconductor/MBR0520LT1G/MBR0520LT1GOSCT-ND/917965; Current - Average Rectified (Io): 500mA; Diode Type: Schottky; LastUpdated: 6/3/2024 7:54:46 PM; Lifecycle Status: Active; Minimum Order: 1; Mounting Type: Surface Mount; Operating Temperature - Junction: -65°C ~ 125°C; Package / Case: SOD-123; Packaging: TapeAndReel; PartId: 2222; Part Status: Active; Price: 0.05; Series: -; Supplier 1: DigiKey; Supplier Part Number 1: MBR0520LT1GOSCT-ND; Supplier Device Package: SOD-123; Voltage - DC Reverse (Vr) (Max): 20V
FB1 = MH1608-101Y: FERRITE BEAD 100 OHM 0603 1LN; Manufacturer: Bourns Inc.; Current Rating (Max): 3A; DC Resistance (DCR) (Max): 40mOhm; Filter Type: Power, Signal Line; Number of Lines: 1; Part Number: MH1608-101Y; ComponentLink1Description: Datasheet; ComponentLink1URL: https://www.bourns.com/docs/Product-Datasheets/mh.pdf; ComponentLink2Description: DigiKey Link; ComponentLink2URL: https://www.digikey.com/en/products/detail/bourns-inc/MH1608-101Y/2563310; Device Package: 0603 (1608 Metric); Height (Max): 0.039" (1.00mm); Impedance @ Frequency: 100 Ohms @ 100 MHz; LastUpdated: 5/9/2023 8:13:07 PM; Lifecycle Status: Active; Minimum Order: 1; Mounting Type: Surface Mount; Operating Temperature: -55°C ~ 125°C; Package / Case: 0603 (1608 Metric); Packaging: TapeAndReel; PartId: 645; Part Status: Active; Price: 0.02; Series: MH; Size / Dimension: 0.063" L x 0.032" W (1.60mm x 0.80mm); Supplier 1: DigiKey; Supplier Part Number 1: MH1608-101YCT-ND; Value: 100 Ohms @ 100 MHz
J1 = CMP-02766-000120-1: CONN HEADER SMD 10POS 1.27MM; Number of Contacts: 10; Row Spacing: 0.05inch; Connector Type: Male Pin; Contact Plating: Gold; Housing Material: Polymer; Length: 6.35mm; Number of Rows: 2; Min Operating Temperature: -55°C; Pitch: 1.27mm; Termination: Solder; Package Quantity: 500; Lead Free: Lead Free; Radiation Hardening: No; Number of Positions: 10; Orientation: Straight; Contact Material: Bronze; Packaging: Tape and Reel; Depth: 5.84mm; Contact Mating Length: 0.12inch; Housing Color: Black; Mount: Surface Mount; Color: Black; Max Operating Temperature: 125°C
R15 R19 R22 R29 R31 R41-R43 = RC0402FR-0710KL: RES 10K OHM 1% 1/16W 0402; Manufacturer: Yageo; Power (Watts): 0.063W, 1/16W; Temperature Coefficient: ±100ppm/°C; Part Number: RC0402FR-0710KL; Value: 10 kOhms; ComponentLink1Description: Datasheet; ComponentLink1URL: https://www.yageo.com/upload/media/product/productsearch/datasheet/rchip/PYu-RC_Group_51_RoHS_L_10.pdf; ComponentLink2Description: DigiKey Link; ComponentLink2URL: https://www.digikey.com/en/products/detail/yageo/RC0402FR-0710KL/726523; Composition: Thick Film; Device Package: 0402 (1005 Metric); Features: Moisture Resistant; Height - Seated (Max): 0.016" (0.40mm); Lifecycle Status: Active; Minimum Order: 1; Number of Terminations: 2; Operating Temperature: -55°C ~ 155°C; Package / Case: 0402 (1005 Metric); Packaging: CutTape; PartId: 17593; Part Status: Active; Price: 0.01; Resistance: 10 kOhms; Series: RC_L; Size / Dimension: 0.039" L x 0.020" W (1.00mm x 0.50mm); Supplier 1: DigiKey; Supplier Part Number 1: 311-10.0KLRCT-ND; Supplier Device Package: 0402; Tolerance: ±1%
  R15 R19 R41-R43: LastUpdated: 4/6/2026 7:41:07 PM
  R22 R29 R31: LastUpdated: 30.04.2023 19:24:29
R30 = RT0402FRE07100RL: RES SMD 100 OHM 1% 1/16W 0402; Manufacturer: Yageo; Power (Watts): 0.063W, 1/16W; Temperature Coefficient: ±50ppm/°C; Part Number: RT0402FRE07100RL; Value: 100 Ohms; ComponentLink1Description: Datasheet; ComponentLink1URL: https://www.yageo.com/upload/media/product/productsearch/datasheet/rchip/PYu-RT_1-to-0.01_RoHS_L_11.pdf; ComponentLink2Description: DigiKey Link; ComponentLink2URL: https://www.digikey.com/en/products/detail/yageo/RT0402FRE07100RL/1071699; Composition: Thin Film; Device Package: 0402 (1005 Metric); Height - Seated (Max): 0.014" (0.35mm); LastUpdated: 4/6/2026 7:41:17 PM; Lifecycle Status: Active; Minimum Order: 1; Number of Terminations: 2; Operating Temperature: -55°C ~ 155°C; Package / Case: 0402 (1005 Metric); Packaging: TapeAndReel; PartId: 3193; Part Status: Active; Price: 0.01; Resistance: 100 Ohms; Series: RT; Size / Dimension: 0.039" L x 0.020" W (1.00mm x 0.50mm); Supplier 1: DigiKey; Supplier Part Number 1: YAG3342CT-ND; Supplier Device Package: 0402; Tolerance: ±1%
R32 R44 = RMCF0402FT2K20: RES 2.2K OHM 1% 1/16W 0402; Manufacturer: Stackpole Electronics Inc; Power (Watts): 0.063W, 1/16W; Temperature Coefficient: ±100ppm/°C; Part Number: RMCF0402FT2K20; Value: 2.2 kOhms; ComponentLink1Description: Datasheet; ComponentLink1URL: https://www.seielect.com/catalog/sei-rmcf_rmcp.pdf; ComponentLink2Description: DigiKey Link; ComponentLink2URL: https://www.digikey.com/en/products/detail/stackpole-electronics-inc/RMCF0402FT2K20/2417439; Composition: Thick Film; Device Package: 0402 (1005 Metric); Features: Automotive AEC-Q200; Height - Seated (Max): 0.016" (0.40mm); LastUpdated: 2/9/2024 8:30:13 PM; Lifecycle Status: Active; Minimum Order: 1; Number of Terminations: 2; Operating Temperature: -55°C ~ 155°C; Package / Case: 0402 (1005 Metric); Packaging: CutTape; PartId: 4919; Part Status: Active; Price: 0.01; Ratings: AEC-Q200; Resistance: 2.2 kOhms; Series: RMCF; Size / Dimension: 0.039" L x 0.020" W (1.00mm x 0.50mm); Supplier 1: DigiKey; Supplier Part Number 1: RMCF0402FT2K20CT-ND; Supplier Device Package: 0402; Tolerance: ±1%
R116 R119 R120 = AC0402JR-070RL: RES SMD 0 OHM JUMPER 1/16W 0402; Manufacturer: Yageo; Power (Watts): 0.063W, 1/16W; Part Number: AC0402JR-070RL; Value: 0 Ohms; ComponentLink1Description: Datasheet; ComponentLink1URL: https://www.yageo.com/upload/media/product/productsearch/datasheet/rchip/PYu-AC_51_RoHS_L_7.pdf; ComponentLink2Description: DigiKey Link; ComponentLink2URL: https://www.digikey.com/en/products/detail/yageo/AC0402JR-070RL/2827807; Composition: Thick Film; Device Package: 0402 (1005 Metric); Features: Automotive AEC-Q200, Moisture Resistant; Height - Seated (Max): 0.015" (0.37mm); LastUpdated: 4/6/2026 7:41:03 PM; Lifecycle Status: Active; Minimum Order: 1; Number of Terminations: 2; Operating Temperature: -55°C ~ 155°C; Package / Case: 0402 (1005 Metric); Packaging: CutTape; PartId: 20617; Part Status: Active; Price: 0.01; Ratings: AEC-Q200; Resistance: 0 Ohms; Series: AC; Size / Dimension: 0.039" L x 0.020" W (1.00mm x 0.50mm); Supplier 1: DigiKey; Supplier Part Number 1: 311-0.0LBCT-ND; Supplier Device Package: 0402; Tolerance: Jumper
U4 = STM32L431RBT6: Ultra-low-power with FPU Arm Cortex-M4 MCU 80 MHz with 128 Kbytes of Flash memory; Manufacturer_Name: STMicroelectronics; Copyright: Copyright (C) 2026 Ultra Librarian. All rights reserved.; Manufacturer_Part_Number: STM32L431RBT6; RefDes: RefDes; Type: Type; Supplier 1: Farnell; Supplier Part Number 1: STM32L431RBT6; MAnufacturer Part Number: STM32L431RBT6
Y1 = TSX-3225 24.0000MF20G-AC3: CRYSTAL 24.0000MHZ 9PF SMD; Manufacturer: EPSON; ESR (Equivalent Series Resistance): 40 Ohms; Frequency Stability: ±20ppm; Frequency Tolerance: ±10ppm; Operating Mode: Fundamental; Part Number: TSX-3225 24.0000MF20G-AC3; ComponentLink1Description: Datasheet; ComponentLink1URL: https://support.epson.biz/td/api/doc_check.php?dl=brief_TSX-3225&lang=en; ComponentLink2Description: DigiKey Link; ComponentLink2URL: https://www.digikey.com/en/products/detail/epson/TSX-3225-24-0000MF20G-AC3/1825443; Frequency: 24 MHz; Height - Seated (Max): 0.024" (0.60mm); LastUpdated: 6/3/2024 8:02:15 PM; Lifecycle Status: Active; Load Capacitance: 9pF; Minimum Order: 1; Mounting Type: Surface Mount; Operating Temperature: -40°C ~ 105°C; Package / Case: 4-SMD, No Lead; Packaging: TapeAndReel; PartId: 440; Part Status: Active; Price: 0.40; Series: TSX-3225; Size / Dimension: 0.126" L x 0.098" W (3.20mm x 2.50mm); Supplier 1: DigiKey; Supplier Part Number 1: SER3634CT-ND; Type: MHz Crystal; Value: 24 MHz
Y2 = ABS06-32.768KHZ-9-T: CRYSTAL 32.7680KHZ 9PF SMD; Manufacturer: Abracon LLC; ESR (Equivalent Series Resistance): 90 kOhms; Frequency Tolerance: ±20ppm; Operating Mode: Fundamental; Part Number: ABS06-32.768KHZ-9-T; ComponentLink1Description: Datasheet; ComponentLink1URL: https://abracon.com/Resonators/ABS06.pdf; ComponentLink2Description: DigiKey Link; ComponentLink2URL: https://www.digikey.com/en/products/detail/abracon-llc/ABS06-32-768KHZ-9-T/2217992; Frequency: 32.768 kHz; Height - Seated (Max): 0.024" (0.60mm); LastUpdated: 4/5/2026 8:41:05 PM; Lifecycle Status: Active; Load Capacitance: 9pF; Minimum Order: 1; Mounting Type: Surface Mount; Operating Temperature: -40°C ~ 85°C; Package / Case: 2-SMD, No Lead; Packaging: TapeAndReel; PartId: 376; Part Status: Active; Price: 0.39; Series: ABS06; Size / Dimension: 0.079" L x 0.047" W (2.00mm x 1.20mm); Supplier 1: DigiKey; Supplier Part Number 1: 535-10246-1-ND; Type: kHz Crystal (Tuning Fork); Value: 32.768 kHz

## Sheet 07_CONNECTORS.SchDoc: =TitleParameter
size A3; Date: 6/12/2026; ApprovedBy: U.KAYACIK; CheckedBy: E. CAGLAV; DrawnBy: E. CAGLAV; Organization: ASISGUARD; Address1: Kemalpasa, Kemalpasa Cd. No:290 D:292H, 35060 Bornova/Izmir/Turkey; Revision: R1; SheetNumber: 7; SheetTotal: 12
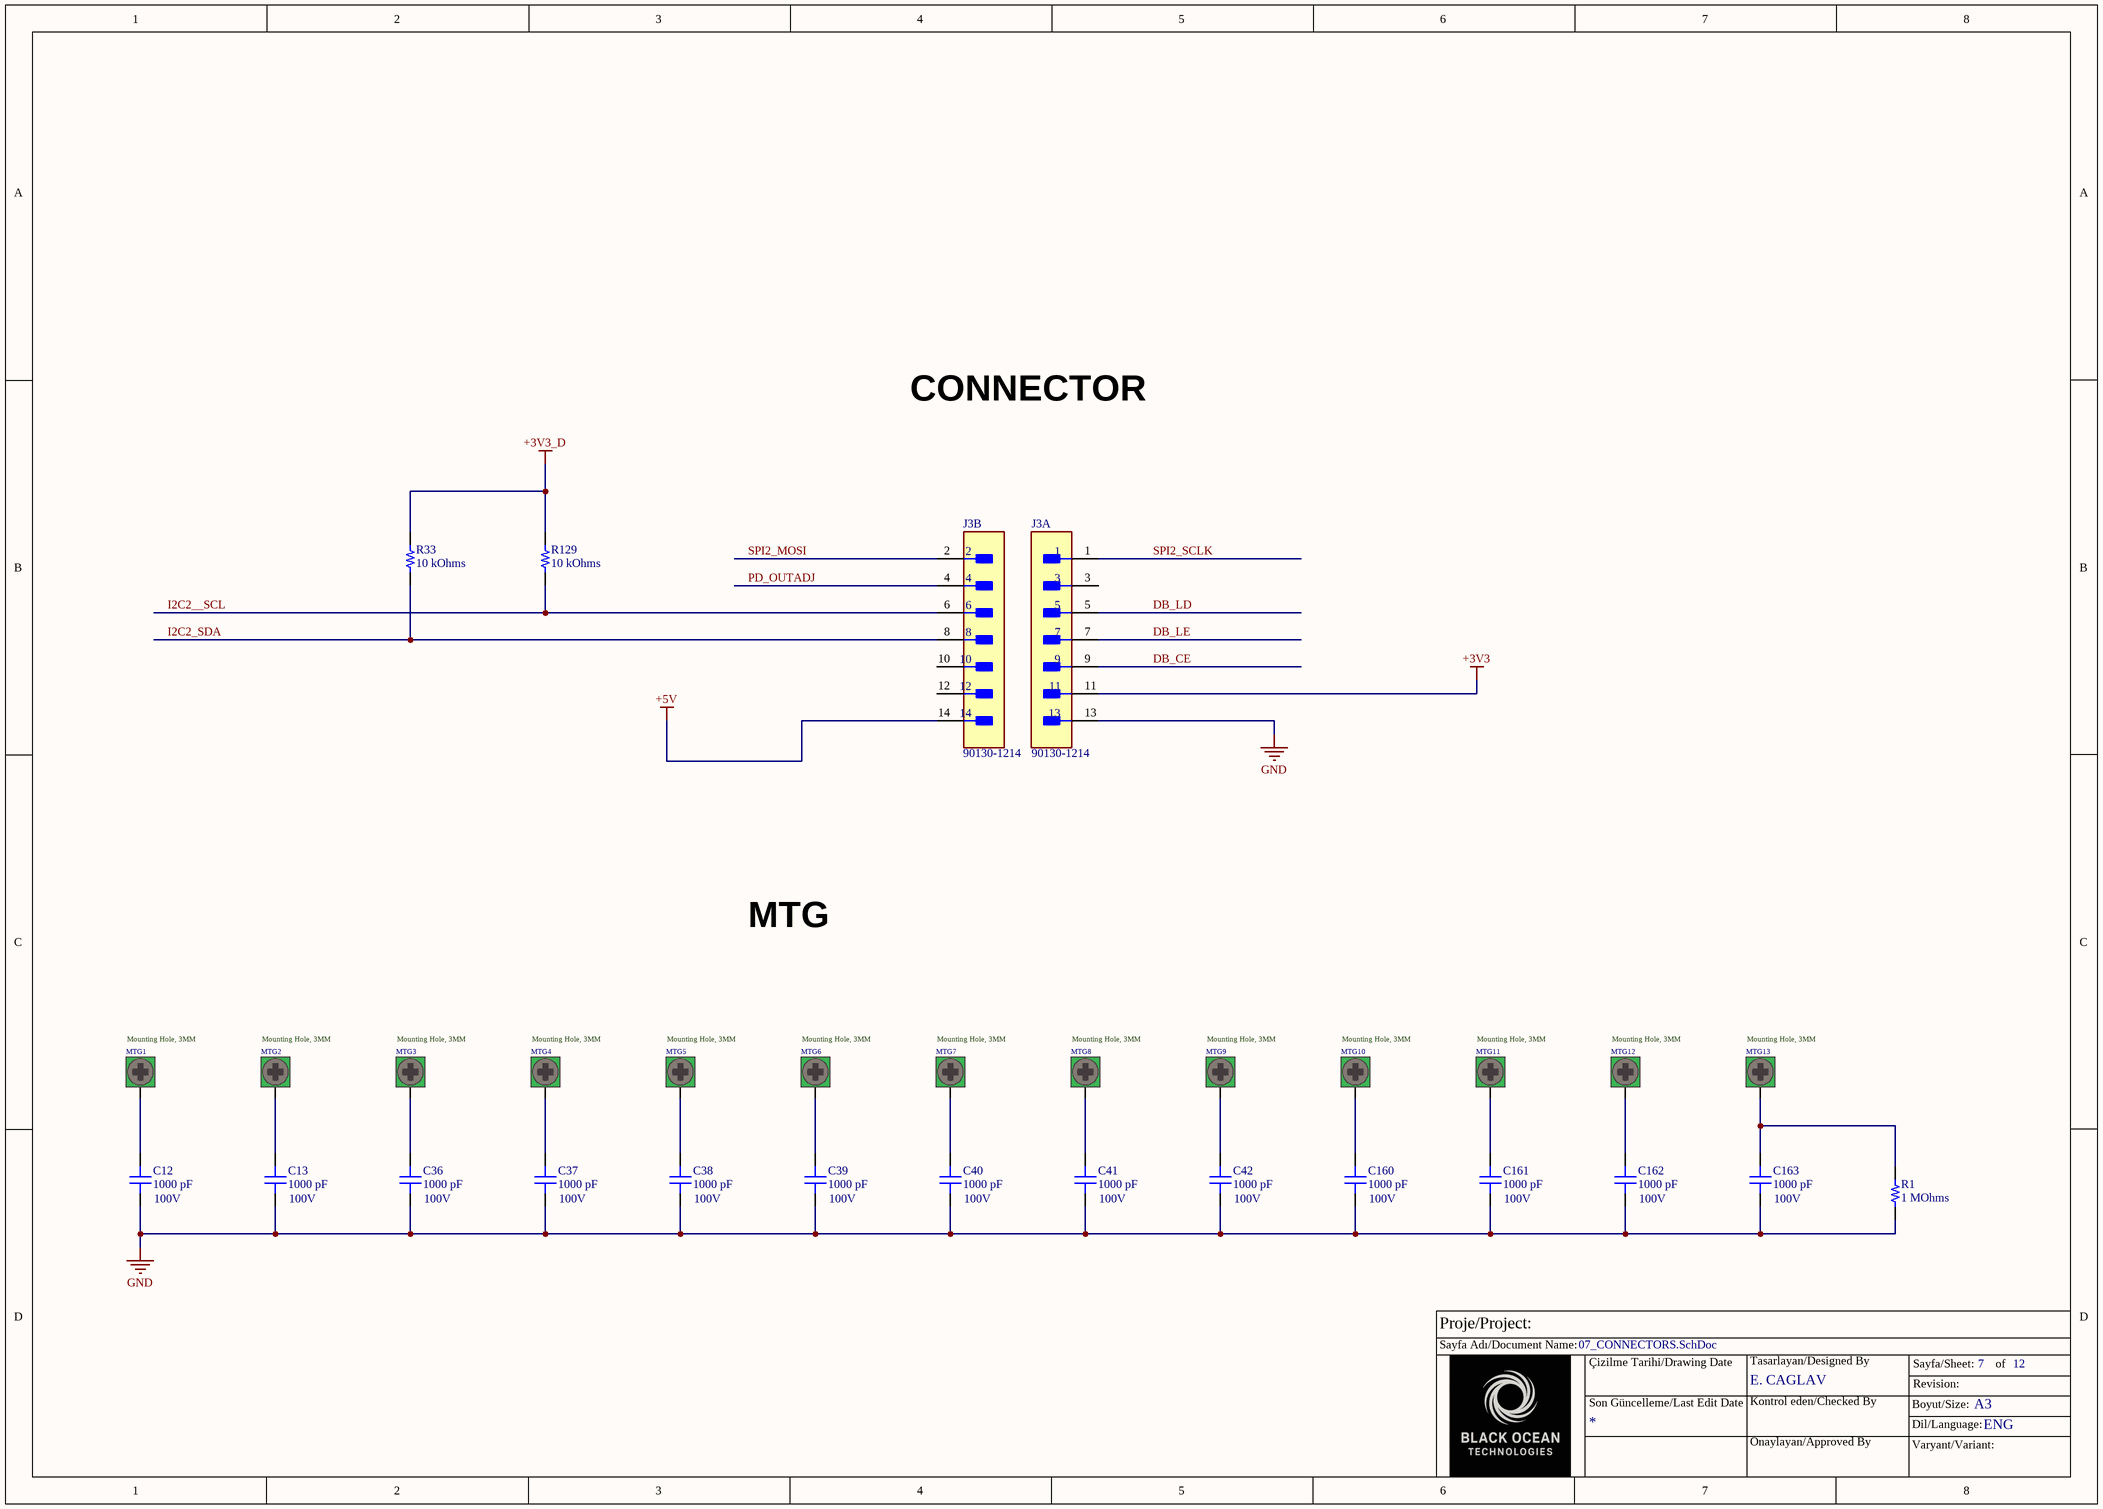
[diagram p6: 07_CONNECTORS.SchDoc]

### Parts
C12  Voltage - Rated: 100V  [CAP 0402_1005]  (hidden comment: 1000 pF)
C13  Voltage - Rated: 100V  [CAP 0402_1005]  (hidden comment: 1000 pF)
C36  Voltage - Rated: 100V  [CAP 0402_1005]  (hidden comment: 1000 pF)
C37  Voltage - Rated: 100V  [CAP 0402_1005]  (hidden comment: 1000 pF)
C38  Voltage - Rated: 100V  [CAP 0402_1005]  (hidden comment: 1000 pF)
C39  Voltage - Rated: 100V  [CAP 0402_1005]  (hidden comment: 1000 pF)
C40  Voltage - Rated: 100V  [CAP 0402_1005]  (hidden comment: 1000 pF)
C41  Voltage - Rated: 100V  [CAP 0402_1005]  (hidden comment: 1000 pF)
C42  Voltage - Rated: 100V  [CAP 0402_1005]  (hidden comment: 1000 pF)
C160  Voltage - Rated: 100V  [CAP 0402_1005]  (hidden comment: 1000 pF)
C161  Voltage - Rated: 100V  [CAP 0402_1005]  (hidden comment: 1000 pF)
C162  Voltage - Rated: 100V  [CAP 0402_1005]  (hidden comment: 1000 pF)
C163  Voltage - Rated: 100V  [CAP 0402_1005]  (hidden comment: 1000 pF)
J3  90130-1214  [FP-90130-1214-MFG]  (parts A,B of 2)
MTG1  Mounting Hole, 3MM  [MTG-PTH-3MM]  (no BOM)
MTG2  Mounting Hole, 3MM  [MTG-PTH-3MM]  (no BOM)
MTG3  Mounting Hole, 3MM  [MTG-PTH-3MM]  (no BOM)
MTG4  Mounting Hole, 3MM  [MTG-PTH-3MM]  (no BOM)
MTG5  Mounting Hole, 3MM  [MTG-PTH-3MM]  (no BOM)
MTG6  Mounting Hole, 3MM  [MTG-PTH-3MM]  (no BOM)
MTG7  Mounting Hole, 3MM  [MTG-PTH-3MM]  (no BOM)
MTG8  Mounting Hole, 3MM  [MTG-PTH-3MM]  (no BOM)
MTG9  Mounting Hole, 3MM  [MTG-PTH-3MM]  (no BOM)
MTG10  Mounting Hole, 3MM  [MTG-PTH-3MM]  (no BOM)
MTG11  Mounting Hole, 3MM  [MTG-PTH-3MM]  (no BOM)
MTG12  Mounting Hole, 3MM  [MTG-PTH-3MM]  (no BOM)
MTG13  Mounting Hole, 3MM  [MTG-PTH-3MM]  (no BOM)
R1  1 MOhms  [RES 0402_1005]
R33  10 kOhms  [RES 0402_1005]
R129  10 kOhms  [RES 0402_1005]

### Nets
+3V3: J3.11
+3V3_D: R33.1 R129.1
+5V: J3.14
GND: C12.1 C13.1 C36.1 C37.1 C38.1 C39.1 C40.1 C41.1 C42.1 C160.1 C161.1 C162.1 C163.1 J3.13 R1.1
DB_CE: J3.9
DB_LD: J3.5
DB_LE: J3.7
I2C2__SCL: J3.6 R129.2
I2C2_SDA: J3.8 R33.2
PD_OUTADJ: J3.4
SPI2_MOSI: J3.2
SPI2_SCLK: J3.1
NetC12_2: C12.2 MTG1.0
NetC13_2: C13.2 MTG2.0
NetC36_2: C36.2 MTG3.0
NetC37_2: C37.2 MTG4.0
NetC38_2: C38.2 MTG5.0
NetC39_2: C39.2 MTG6.0
NetC40_2: C40.2 MTG7.0
NetC41_2: C41.2 MTG8.0
NetC42_2: C42.2 MTG9.0
NetC160_2: C160.2 MTG10.0
NetC161_2: C161.2 MTG11.0
NetC162_2: C162.2 MTG12.0
NetC163_2: C163.2 MTG13.0 R1.2

Not connected (* = marked no-connect by the designer): J3 3 10 12

### Notes on the sheet
- CONNECTOR
- MTG
- Proje/Project:
- Sayfa Adı/Document Name:
- Çizilme Tarihi/Drawing Date
- E. CAGLAV
- Tasarlayan/Designed By
- Sayfa/Sheet:
- Revision:
- of
- Son Güncelleme/Last Edit Date
- Kontrol eden/Checked By
- Onaylayan/Approved By
- Boyut/Size:
- Varyant/Variant:
- Dil/Language:
- A3
- ENG

### Library data of the parts
C12 C13 C36-C42 C160-C163 = C0402H102J1GAC7867: as C49 on sheet 05_3V3_GENERATION; Part Number: C0402H102J1GAC7867; Capacitance: 1000 pF; Applications: Downhole; componentlink1description: Datasheet; componentlink1url: https://api.kemet.com/component-edge/download/datasheet/C0402H102J1GAC7867.pdf; componentlink2description: DigiKey Link; componentlink2url: https://www.digikey.com/en/products/detail/kemet/C0402H102J1GAC7867/5267578; Device Package: 0402 (1005 Metric); Features: Low ESL, High Temperature; lastupdated: 3/30/2026 7:10:31 PM; Lifecycle Status: Active; Minimum Order: 1; Mounting Type: Surface Mount, MLCC; Operating Temperature: -55°C ~ 200°C; Package / Case: 0402 (1005 Metric); packaging: TapeAndReel; partid: 3822; Part Status: Active; price: 0.24; series: SMD Indust C0G HT200C; Size / Dimension: 0.039" L x 0.020" W (1.00mm x 0.50mm); Supplier 1: DigiKey; Supplier Part Number 1: 399-11931-1-ND; Thickness (Max): 0.022" (0.55mm); value: 1000 pF
J3 = CMP-00257-00655589-1: 90130-1214 Conn Shrouded Header (4 Sides) HDR 14 POS 2.54mm Solder ST Top Entry Thru-Hole C-Grid III™ Tray; NexarPartId: 655589; Voltage Rating (AC): 350V; Gender: Male; Number of Circuits: 14; Connector Type: Male Pin; Mating Post Length: 6.75mm; Lead Length: 2.9mm; Contact Resistance: 20mΩ; Insulation Resistance: 5GΩ; Max Voltage Rating (DC): 350.35kV; Current Rating: 3A; Glow Wire Compliant: Non-compliant; RoHS: Compliant; Schedule B: 8536694040; Voltage Rating (DC): 350V; Lead Free: Lead Free; Row Spacing: 2.54mm; Color: Black; Voltage Rating: 350V; Housing Material: Polyester; Lead Pitch: 2.54mm; Radiation Hardening: No; Working Voltage: 350V; Pitch: 2.54mm; Orientation: Vertical; Housing Color: Black; Contact Material: Brass; Number of Poles: 14; Min Operating Temperature: -55°C; Number of Rows: 2; Termination: Solder; Number of Contacts: 14; Material: Glass, Polyester; Contact Plating: Gold; Number of Positions: 14; Max Operating Temperature: 125°C; Contact Gender: Male; REACH SVHC: No SVHC; Mount: Through Hole; Contact Mating Length: 6.7564mm
MTG1-MTG13 = MTG3MM
R1 = RE0402FRE071ML: RES SMD 1M OHM 1% 1/16W 0402; Manufacturer: Yageo; Power (Watts): 0.063W, 1/16W; Temperature Coefficient: ±50ppm/°C; Part Number: RE0402FRE071ML; Value: 1 MOhms; ComponentLink1Description: Datasheet; ComponentLink1URL: https://www.yageo.com/upload/media/product/productsearch/datasheet/rchip/PYu-RE_105_RoHS_L_7.pdf; ComponentLink2Description: DigiKey Link; ComponentLink2URL: https://www.digikey.com/en/products/detail/yageo/RE0402FRE071ML/5923009; Composition: Thick Film; Device Package: 0402 (1005 Metric); Height - Seated (Max): 0.015" (0.37mm); LastUpdated: 4/6/2026 7:40:51 PM; Lifecycle Status: Active; Minimum Order: 1; Number of Terminations: 2; Operating Temperature: -55°C ~ 155°C; Package / Case: 0402 (1005 Metric); Packaging: CutTape; PartId: 78753; Price: 0.01; Resistance: 1 MOhms; Series: RE; Size / Dimension: 0.039" L x 0.020" W (1.00mm x 0.50mm); Supplier 1: DigiKey; Supplier Part Number 1: 13-RE0402FRE071MLCT-ND; Supplier Device Package: 0402; Tolerance: ±1%
R33 R129 = RC0402FR-0710KL: as R15 on sheet 06_MCU; Part Number: RC0402FR-0710KL; Value: 10 kOhms; ComponentLink1Description: Datasheet; ComponentLink1URL: https://www.yageo.com/upload/media/product/productsearch/datasheet/rchip/PYu-RC_Group_51_RoHS_L_10.pdf; ComponentLink2Description: DigiKey Link; ComponentLink2URL: https://www.digikey.com/en/products/detail/yageo/RC0402FR-0710KL/726523; Composition: Thick Film; Device Package: 0402 (1005 Metric); Features: Moisture Resistant; Height - Seated (Max): 0.016" (0.40mm); LastUpdated: 30.04.2023 19:24:29; Lifecycle Status: Active; Minimum Order: 1; Number of Terminations: 2; Operating Temperature: -55°C ~ 155°C; Package / Case: 0402 (1005 Metric); Packaging: CutTape; PartId: 17593; Part Status: Active; Price: 0.01; Resistance: 10 kOhms; Series: RC_L; Size / Dimension: 0.039" L x 0.020" W (1.00mm x 0.50mm); Supplier 1: DigiKey; Supplier Part Number 1: 311-10.0KLRCT-ND; Supplier Device Package: 0402; Tolerance: ±1%

## Sheet 08_EPROM_UNIQUE_SERIAL.SchDoc: =TitleParameter
size A3; Date: 6/12/2026; ApprovedBy: U.KAYACIK; CheckedBy: E. CAGLAV; DrawnBy: E. CAGLAV; Organization: ASISGUARD; Address1: Kemalpasa, Kemalpasa Cd. No:290 D:292H, 35060 Bornova/Izmir/Turkey; Revision: R1
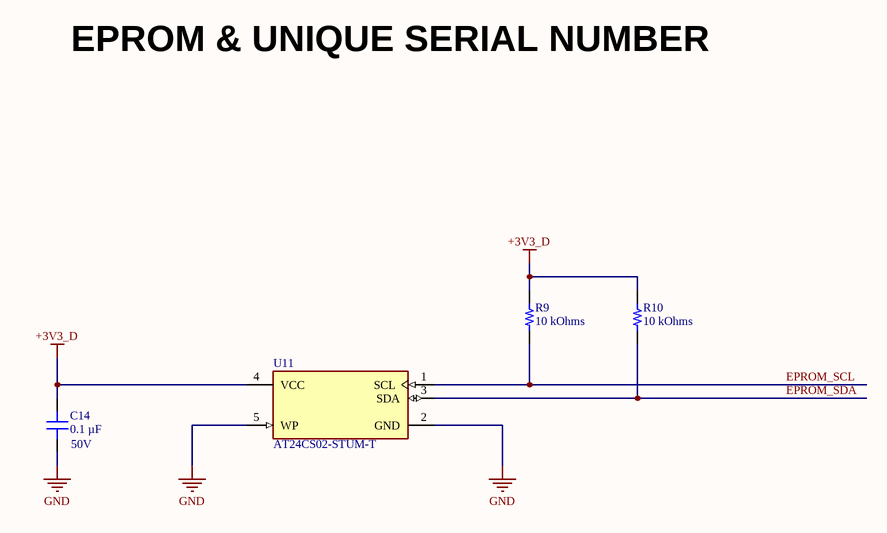
[diagram p7: 08_EPROM_UNIQUE_SERIAL.SchDoc]

### Parts
C14  Voltage - Rated: 50V  [CAP 0402_1005]  (hidden comment: 0.1 µF)
R9  10 kOhms  [RES 0402_1005]
R10  10 kOhms  [RES 0402_1005]
U11  AT24CS02-STUM-T  [FP-C04-21344-MFG]

### Nets
+3V3_D: C14.2 R9.2 R10.2 U11.4(VCC)
GND: C14.1 U11.2(GND) U11.5(WP)
EPROM_SCL: R9.1 U11.1(SCL)
EPROM_SDA: R10.1 U11.3(SDA)

### Notes on the sheet
- EPROM & UNIQUE SERIAL NUMBER
- Proje/Project:
- Sayfa Adı/Document Name:
- Çizilme Tarihi/Drawing Date
- E. CAGLAV
- Tasarlayan/Designed By
- Sayfa/Sheet:
- Revision:
- of
- Son Güncelleme/Last Edit Date
- Kontrol eden/Checked By
- Onaylayan/Approved By
- Boyut/Size:
- Varyant/Variant:
- Dil/Language:
- A3
- ENG

### Library data of the parts
C14 = GCM155R71H104KE02J: as C44 on sheet 05_3V3_GENERATION; Part Number: GCM155R71H104KE02J; Capacitance: 0.1 µF; Applications: Automotive; componentlink1description: Datasheet; componentlink1url: https://search.murata.co.jp/Ceramy/image/img/A01X/G101/ENG/GCM155R71H104KE02-01.pdf; componentlink2description: DigiKey Link; componentlink2url: https://www.digikey.com/en/products/detail/murata-electronics/GCM155R71H104KE02J/4903705; Device Package: 0402 (1005 Metric); lastupdated: 4/6/2026 7:10:30 PM; Lifecycle Status: Active; Minimum Order: 1; Mounting Type: Surface Mount, MLCC; Operating Temperature: -55°C ~ 125°C; Package / Case: 0402 (1005 Metric); packaging: TapeAndReel; partid: 11356; Part Status: Active; price: 0.01; Ratings: AEC-Q200; series: GCM; Size / Dimension: 0.039" L x 0.020" W (1.00mm x 0.50mm); Supplier 1: DigiKey; Supplier Part Number 1: 490-14514-1-ND; Temperature Coefficient: X7R; Thickness (Max): 0.022" (0.55mm); value: 0.1 µF
R9 R10 = RC0402FR-0710KL: as R15 on sheet 06_MCU; Part Number: RC0402FR-0710KL; Value: 10 kOhms; ComponentLink1Description: Datasheet; ComponentLink1URL: https://www.yageo.com/upload/media/product/productsearch/datasheet/rchip/PYu-RC_Group_51_RoHS_L_10.pdf; ComponentLink2Description: DigiKey Link; ComponentLink2URL: https://www.digikey.com/en/products/detail/yageo/RC0402FR-0710KL/726523; Composition: Thick Film; Device Package: 0402 (1005 Metric); Features: Moisture Resistant; Height - Seated (Max): 0.016" (0.40mm); LastUpdated: 4/6/2026 7:41:07 PM; Lifecycle Status: Active; Minimum Order: 1; Number of Terminations: 2; Operating Temperature: -55°C ~ 155°C; Package / Case: 0402 (1005 Metric); Packaging: CutTape; PartId: 17593; Part Status: Active; Price: 0.01; Resistance: 10 kOhms; Series: RC_L; Size / Dimension: 0.039" L x 0.020" W (1.00mm x 0.50mm); Supplier 1: DigiKey; Supplier Part Number 1: 311-10.0KLRCT-ND; Supplier Device Package: 0402; Tolerance: ±1%
U11 = CMP-06313-000046-1: IC EEPROM 2K I2C 1MHZ SOT23-5